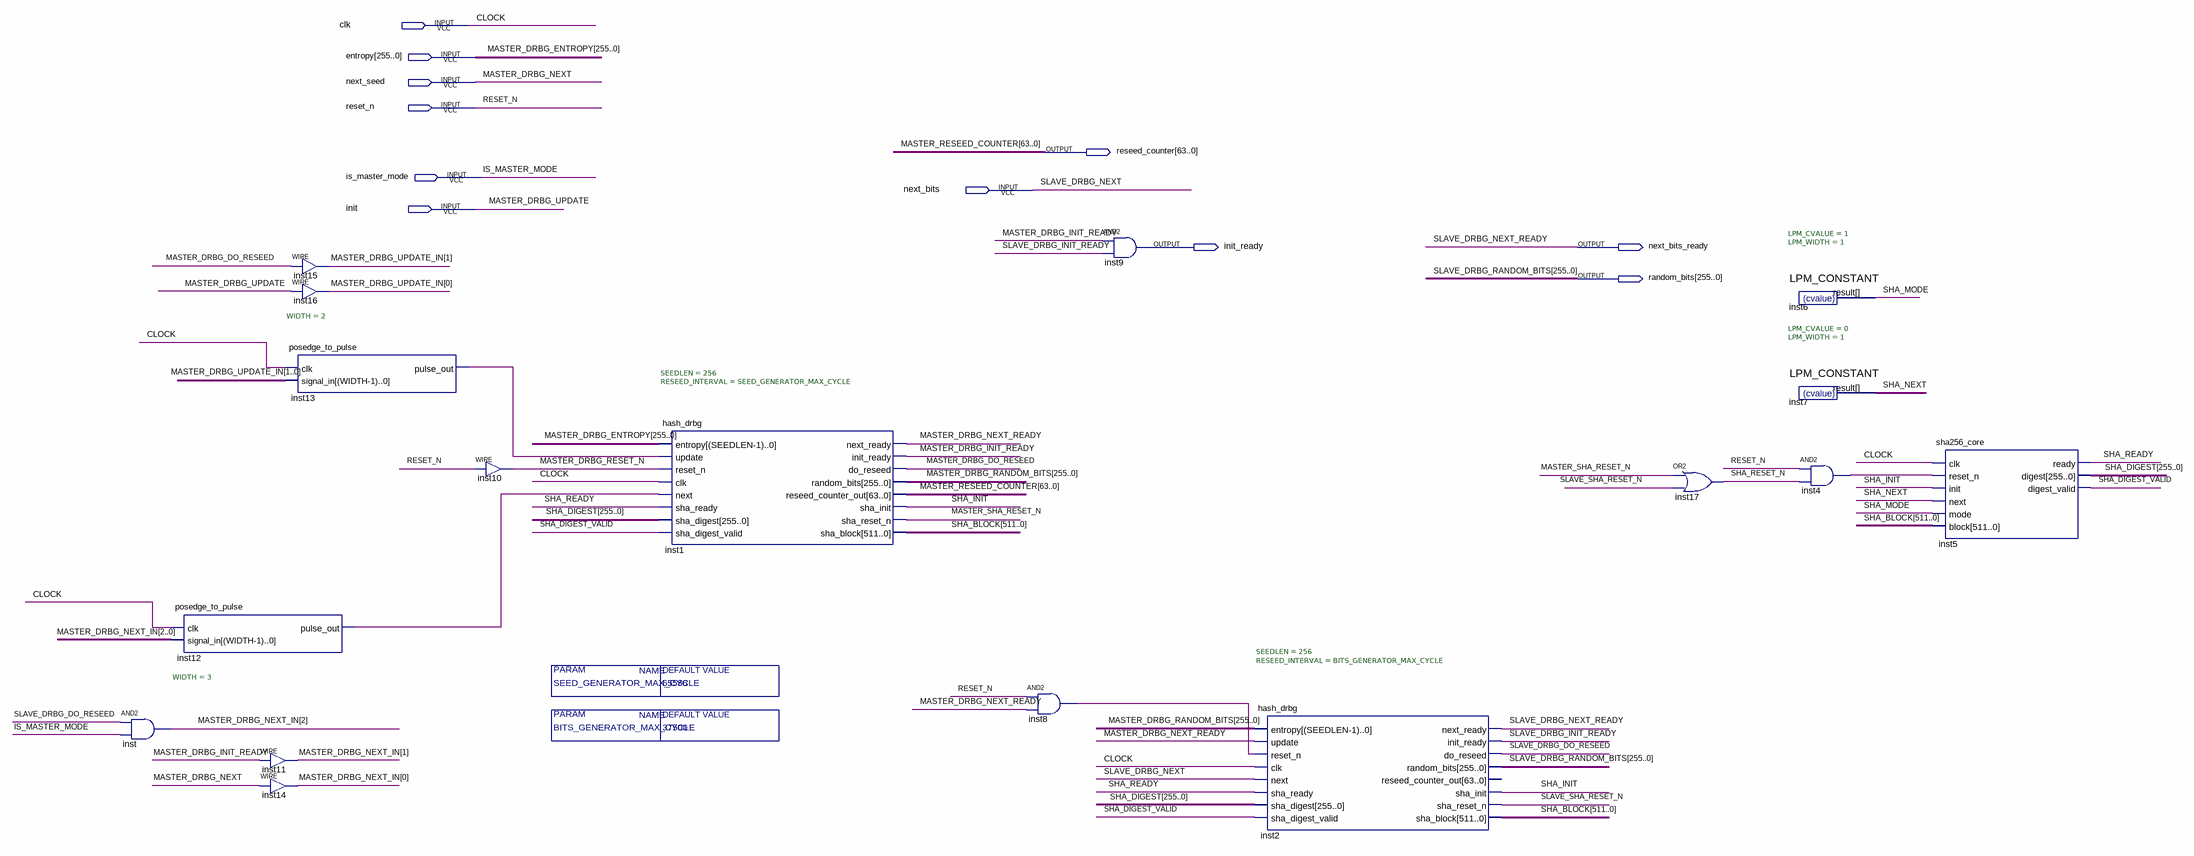
[diagram p0: schematic sheet]
// Quartus schematic double_hash_drbg.bdf as structural Verilog: 17 symbols, 11 pins
module double_hash_drbg #(parameter SEED_GENERATOR_MAX_CYCLE = 65536, parameter BITS_GENERATOR_MAX_CYCLE = 37500) (
  input  clk,
  input  [255:0] entropy,
  input  next_seed,
  input  reset_n,
  input  is_master_mode,
  input  next_bits,
  input  init,
  output [63:0] reseed_counter,
  output init_ready,
  output next_bits_ready,
  output [255:0] random_bits
);

  wire inst4_out, inst8_out, inst12_pulse_out, inst13_pulse_out, MASTER_DRBG_DO_RESEED,
       MASTER_DRBG_INIT_READY, MASTER_DRBG_NEXT_READY, MASTER_DRBG_RESET_N, MASTER_SHA_RESET_N,
       SHA_DIGEST_VALID, SHA_INIT, SHA_MODE, SHA_NEXT, SHA_READY, SHA_RESET_N, SLAVE_DRBG_DO_RESEED,
       SLAVE_DRBG_INIT_READY, SLAVE_SHA_RESET_N;
  wire [1:0] MASTER_DRBG_UPDATE_IN;
  wire [2:0] MASTER_DRBG_NEXT_IN;
  wire [255:0] MASTER_DRBG_RANDOM_BITS, SHA_DIGEST;
  wire [511:0] SHA_BLOCK;

  and inst (MASTER_DRBG_NEXT_IN[2], SLAVE_DRBG_DO_RESEED, is_master_mode);
  posedge_to_pulse #(.WIDTH(3)) inst12 (.clk(clk), .signal_in(MASTER_DRBG_NEXT_IN), .pulse_out(inst12_pulse_out));
  assign MASTER_DRBG_NEXT_IN[1] = MASTER_DRBG_INIT_READY;  // WIRE inst11
  assign MASTER_DRBG_NEXT_IN[0] = next_seed;  // WIRE inst14
  assign MASTER_DRBG_UPDATE_IN[1] = MASTER_DRBG_DO_RESEED;  // WIRE inst15
  assign MASTER_DRBG_UPDATE_IN[0] = init;  // WIRE inst16
  posedge_to_pulse #(.WIDTH(2)) inst13 (.clk(clk), .signal_in(MASTER_DRBG_UPDATE_IN), .pulse_out(inst13_pulse_out));
  assign MASTER_DRBG_RESET_N = reset_n;  // WIRE inst10
  hash_drbg #(.SEEDLEN(256), .RESEED_INTERVAL(SEED_GENERATOR_MAX_CYCLE)) inst1 (
    .entropy(entropy), .update(inst13_pulse_out), .reset_n(MASTER_DRBG_RESET_N), .clk(clk),
    .next(inst12_pulse_out), .sha_ready(SHA_READY), .sha_digest(SHA_DIGEST),
    .sha_digest_valid(SHA_DIGEST_VALID), .next_ready(MASTER_DRBG_NEXT_READY),
    .init_ready(MASTER_DRBG_INIT_READY), .do_reseed(MASTER_DRBG_DO_RESEED),
    .random_bits(MASTER_DRBG_RANDOM_BITS), .reseed_counter_out(reseed_counter), .sha_init(SHA_INIT),
    .sha_reset_n(MASTER_SHA_RESET_N), .sha_block(SHA_BLOCK));
  and inst8 (inst8_out, reset_n, MASTER_DRBG_NEXT_READY);
  and inst9 (init_ready, MASTER_DRBG_INIT_READY, SLAVE_DRBG_INIT_READY);
  hash_drbg #(.SEEDLEN(256), .RESEED_INTERVAL(BITS_GENERATOR_MAX_CYCLE)) inst2 (
    .entropy(MASTER_DRBG_RANDOM_BITS), .update(MASTER_DRBG_NEXT_READY), .reset_n(inst8_out), .clk(clk),
    .next(next_bits), .sha_ready(SHA_READY), .sha_digest(SHA_DIGEST), .sha_digest_valid(SHA_DIGEST_VALID),
    .next_ready(next_bits_ready), .init_ready(SLAVE_DRBG_INIT_READY), .do_reseed(SLAVE_DRBG_DO_RESEED),
    .random_bits(random_bits), .sha_init(SHA_INIT), .sha_reset_n(SLAVE_SHA_RESET_N), .sha_block(SHA_BLOCK));  // open: reseed_counter_out
  or inst17 (SHA_RESET_N, MASTER_SHA_RESET_N, SLAVE_SHA_RESET_N);
  LPM_CONSTANT #(.LPM_CVALUE(1), .LPM_WIDTH(1)) inst6 (.result(SHA_MODE));
  LPM_CONSTANT #(.LPM_CVALUE(0), .LPM_WIDTH(1)) inst7 (.result(SHA_NEXT));
  and inst4 (inst4_out, reset_n, SHA_RESET_N);
  sha256_core inst5 (
    .clk(clk), .reset_n(inst4_out), .init(SHA_INIT), .next(SHA_NEXT), .mode(SHA_MODE), .block(SHA_BLOCK),
    .ready(SHA_READY), .digest(SHA_DIGEST), .digest_valid(SHA_DIGEST_VALID));

  // Other names for the same wires on the sheet: CLOCK = clk; MASTER_DRBG_ENTROPY[255:0] = entropy;
  //   MASTER_DRBG_NEXT = next_seed; MASTER_DRBG_UPDATE = init; MASTER_RESEED_COUNTER[63:0] = reseed_counter;
  //   SLAVE_DRBG_NEXT = next_bits; SLAVE_DRBG_NEXT_READY = next_bits_ready;
  //   SLAVE_DRBG_RANDOM_BITS[255:0] = random_bits
endmodule
